# EAGLE design FET_mux_2layer (EAGLE 9.1.0)
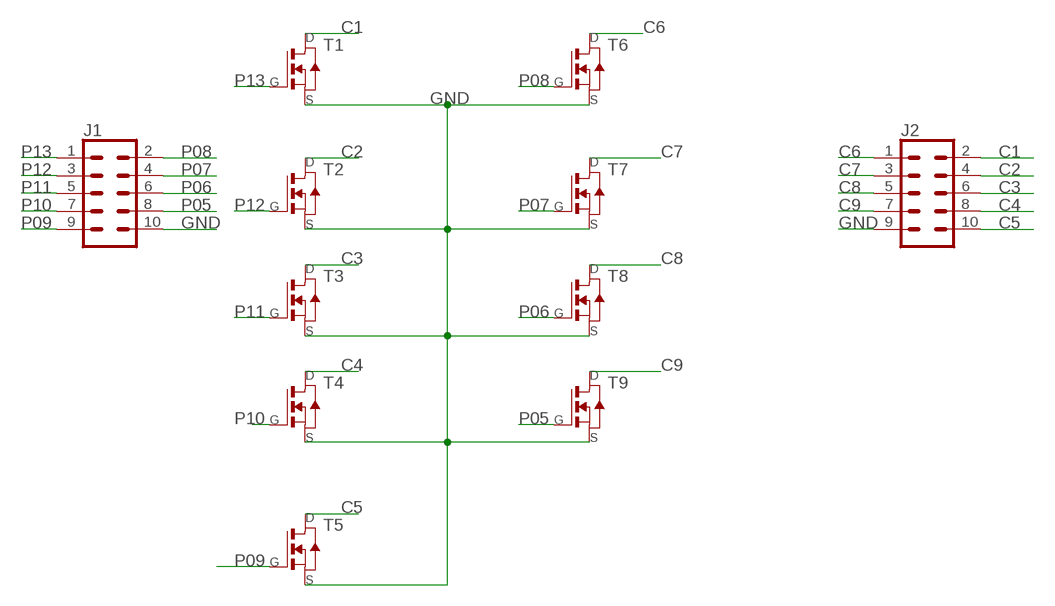
[diagram p0: schematic, sheet 1]

## Parts
J1  CONN_05X2SHD_SMD  [2X5-SHROUDED_SMD]
J2  CONN_05X2SHD_SMD  [2X5-SHROUDED_SMD]
T1  NMOSFETSOT23  [SOT-23]
T2  NMOSFETSOT23  [SOT-23]
T3  NMOSFETSOT23  [SOT-23]
T4  NMOSFETSOT23  [SOT-23]
T5  NMOSFETSOT23  [SOT-23]
T6  NMOSFETSOT23  [SOT-23]
T7  NMOSFETSOT23  [SOT-23]
T8  NMOSFETSOT23  [SOT-23]
T9  NMOSFETSOT23  [SOT-23]

## Nets
C1: J2.2 T1.1(D)
C2: J2.4 T2.1(D)
C3: J2.6 T3.1(D)
C4: J2.8 T4.1(D)
C5: J2.10 T5.1(D)
C6: J2.1 T6.1(D)
C7: J2.3 T7.1(D)
C8: J2.5 T8.1(D)
C9: J2.7 T9.1(D)
GND: J1.10 J2.9 T1.2(S) T2.2(S) T3.2(S) T4.2(S) T5.2(S) T6.2(S) T7.2(S) T8.2(S) T9.2(S)
P05: J1.8 T9.3(G)
P06: J1.6 T8.3(G)
P07: J1.4 T7.3(G)
P08: J1.2 T6.3(G)
P09: J1.9 T5.3(G)
P10: J1.7 T4.3(G)
P11: J1.5 T3.3(G)
P12: J1.3 T2.3(G)
P13: J1.1 T1.3(G)

## Library data of the parts
J1 J2 = fab:CONN_05X2: Multi connection point. Often used as Generic Header-pin footprint for 0.1 inch spaced/style header connections For AVR SPI programming port, see special device with nice symbol: "AVR_SPI_PROG_5x2.dev" You can populate with any combo of single row headers, but if you'd like an exact match, check these: 2x5 AVR ICSP Male Header <https://www.sparkfun.com/products/778> (PRT-00778) 2x5 Pin Shrouded Header <https://www.sparkfun.com/products/8506> (PRT-08506) On any of the 0.1 inch spaced packages, you can populate with these: Break Away Headers - Straight <https://www.sparkfun.com/products/116> (PRT-00116) Break Away Male Headers - Right Angle <https://www.sparkfun.com/products/553> (PRT-00553) Female Headers <https://www.sparkfun.com/products/115> (PRT-00115) Break Away Headers - Machine Pin <https://www.sparkfun.com/products/117> (PRT-00117) Break Away Female Headers - Swiss Machine Pin <https://www.sparkfun.com/products/743> (PRT-00743) Special note: the shrouded connector mates well with our 5x2 ribbon cables: 2x5 Pin IDC Ribbon Cable <https://www.sparkfun.com/products/8535> (PRT-08535); PROD_ID: CONN-09508
T1-T9 = fab:NMOSFET: MOS FET

## Board
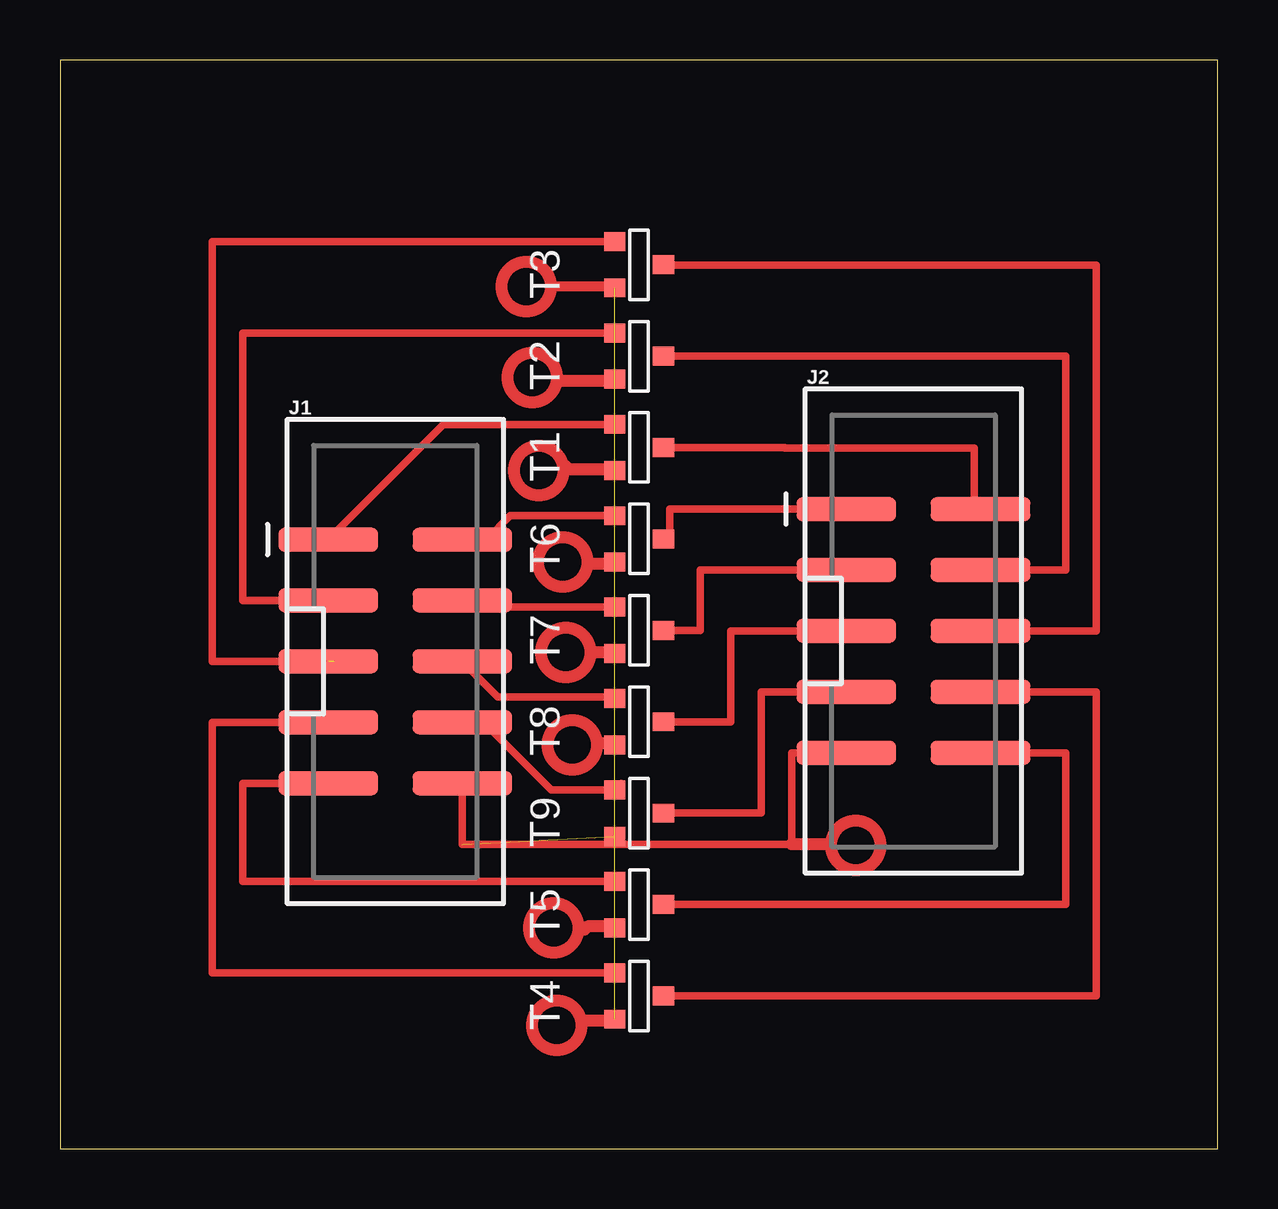
[diagram p1: board, top side]
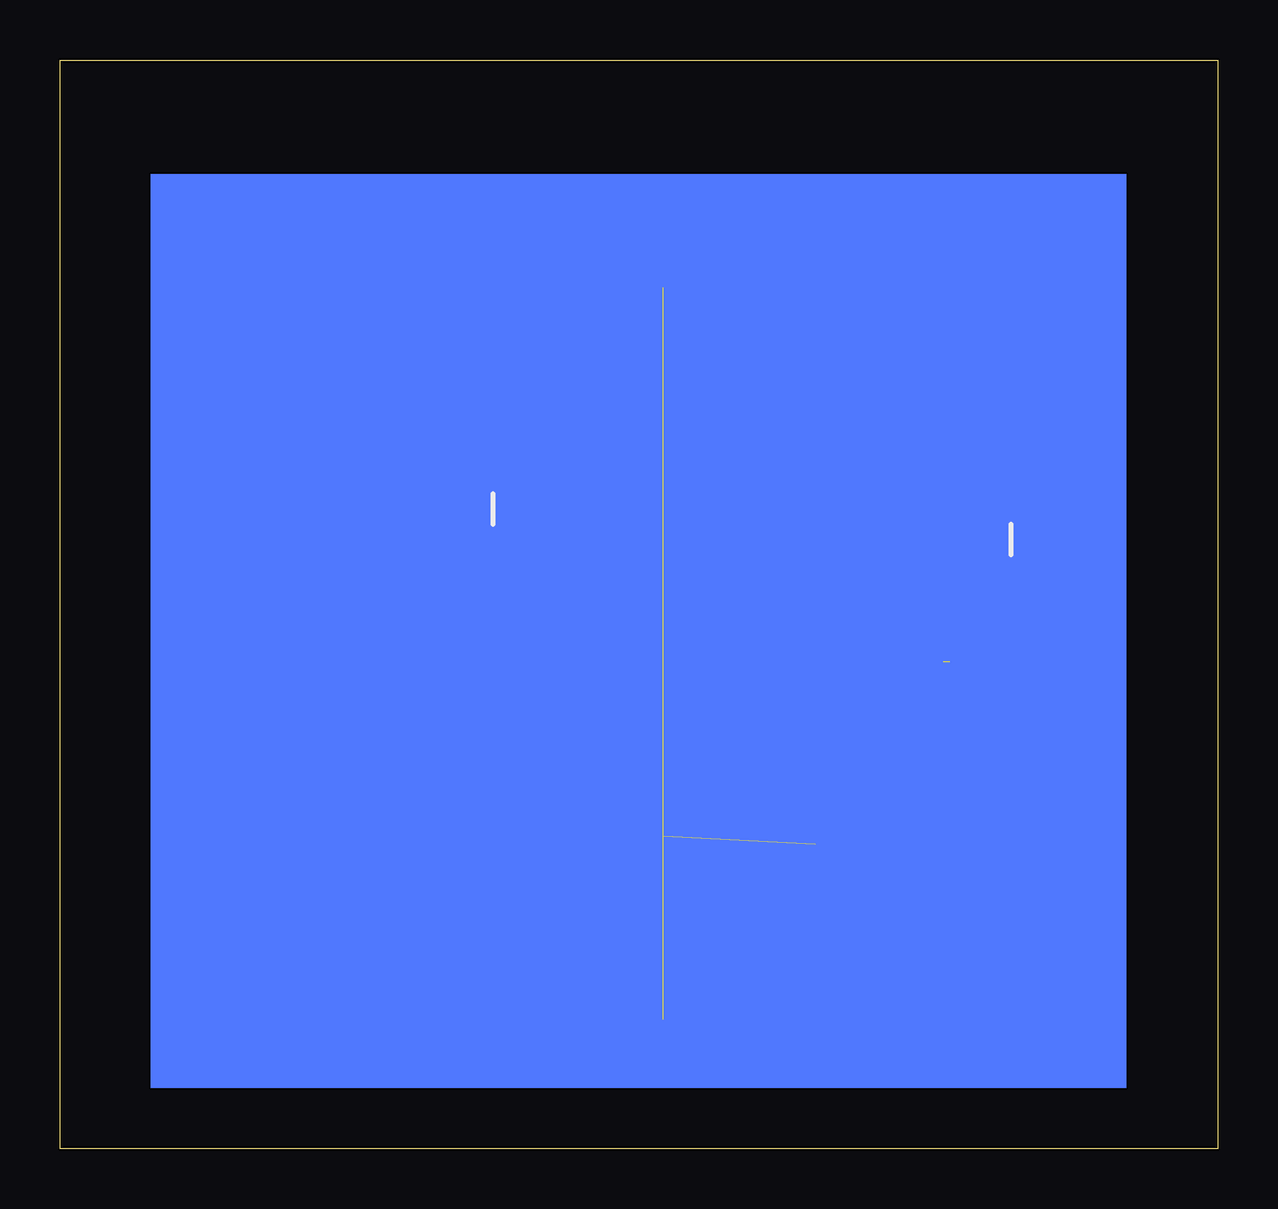
[diagram p2: board, bottom side, seen from below]

Size 48.24 x 45.39 mm. Coordinates in mm from the lower left corner, seen from the top.
Outline: 0,0 48.24,0 48.24,45.39 0,45.39 0,0
Copper layers (1*16): Top 0.035mm / dielectric 1.5mm / Bottom 0.035mm
Design rules "default": minimum track width 6mil, minimum drill 0.35mm, track to track 6mil, track to pad 6mil, pad to pad 6mil, via to via 6mil, smd to smd 6mil, copper to edge 40mil, drill to drill 6mil, minimum pad ring 10mil, minimum via ring 8mil, stop-mask expansion 4mil, vias tented up to drill 0mil, thermal gap 10mil

### Footprints (pad centres in the part's own frame; a part is rotated, then mirrored left to right if it is on the bottom)
2X5-SHROUDED_SMD = smd 4.15 x 1: 1 -2.794,5.08; 2 2.794,5.08; 3 -2.794,2.54; 4 2.794,2.54; 5 -2.794,0; 6 2.794,0; 7 -2.794,-2.54; 8 2.794,-2.54; 9 -2.794,-5.08; 10 2.794,-5.08
SOT-23 = smd 0.787 x 0.889: 1 0.025,-1.016; 2 -0.94,1.016; 3 0.991,1.016

### Placement (x,y rotation side)
J1  13.97,20.32 0 top
J2  35.56,21.59 0 top
T1  24.13,29.21 90 top
T2  24.13,33.02 90 top
T3  24.13,36.83 90 top
T4  24.13,6.35 90 top
T5  24.13,10.16 90 top
T6  24.13,25.4 90 top
T7  24.13,21.59 90 top
T8  24.13,17.78 90 top
T9  24.13,13.97 90 top

### Tracks (layer width: path | path; a pad name or v marks a point on that pad's centre or on a via)
C1
  Top 0.305: T1.1 30.2,29.23 30.2,29.21 38.1,29.21 38.1,26.92 J2.2
C2
  Top 0.305: T2.1 41.91,33.05 41.91,24.13 J2.4 38.1,24.13
C3
  Top 0.305: T3.1 25.15,36.83 43.18,36.83 43.18,21.59 J2.6
C4
  Top 0.305: T4.1 43.18,6.38 43.18,19.05 J2.8 38.1,19.05
C5
  Top 0.305: T5.1 41.91,10.19 41.91,16.51 J2.10
C6
  Top 0.305: T6.1 25.4,25.43 25.4,26.67 J2.1
C7
  Top 0.305: T7.1 26.67,21.61 26.67,24.13 J2.3 33.02,24.13 34.29,24.13
C8
  Top 0.305: T8.1 27.94,17.8 27.94,21.59 J2.5
C9
  Top 0.305: T9.1 29.21,13.99 29.21,19.05 J2.7
GND  (9 unrouted)
  Top 0.305: J2.9 30.48,16.51 30.48,12.7 16.76,12.7 J1.10
  Top 0.508: 32,12.7 30.48,12.7
N$1
  Top 0.406: 22.86,35.94 20.45,35.94
N$2
  Top 0.508: 22.73,32 20.7,32
N$3
  Top 0.508: 22.86,28.32 21.21,28.32 21.08,28.45
N$4
  Top 0.508: 22.99,24.38 22.1,24.38
N$5
  Top 0.508: 23.11,20.7 22.23,20.7
N$6
  Top 0.508: 22.99,16.76 22.86,16.89 22.48,16.89
N$7
  Top 0.508: 22.86,9.27 21.97,9.27 21.84,9.14
N$8
  Top 0.508: 22.86,5.46 22.73,5.33 21.84,5.33
P05
  Top 0.305: 23.39,15.24 T9.3 | T9.3 22.86,14.71 | J1.8 17.65,17.78 20.47,14.96 T9.3
  Top 0.406: J1.8 18.54,17.78
P06
  Top 0.305: T8.3 23.04,18.85 18.24,18.85 J1.6
P07
  Top 0.305: T7.3 17.04,22.58 J1.4
P08
  Top 0.305: T6.3 18.77,26.39 17.78,25.4 J1.2
P09
  Top 0.305: T5.3 7.62,11.15 7.62,15.24 J1.9 12.7,15.24
P10
  Top 0.305: T4.3 6.35,7.34 6.35,17.78 J1.7
P11  (1 unrouted)
  Top 0.305: T3.3 6.35,37.82 6.35,20.32 11.43,20.32
P12
  Top 0.305: T2.3 7.62,34.01 7.62,22.86 J1.3
P13
  Top 0.305: T1.3 15.98,30.2 J1.1
(copper drawn outside any net)
  shapes: Bottom area x1, Top circle x10